# Altium schematic sheet MEMSAndAnalogFrontend.SchDoc
size A3; SheetNumber: 4; SheetTotal: 4
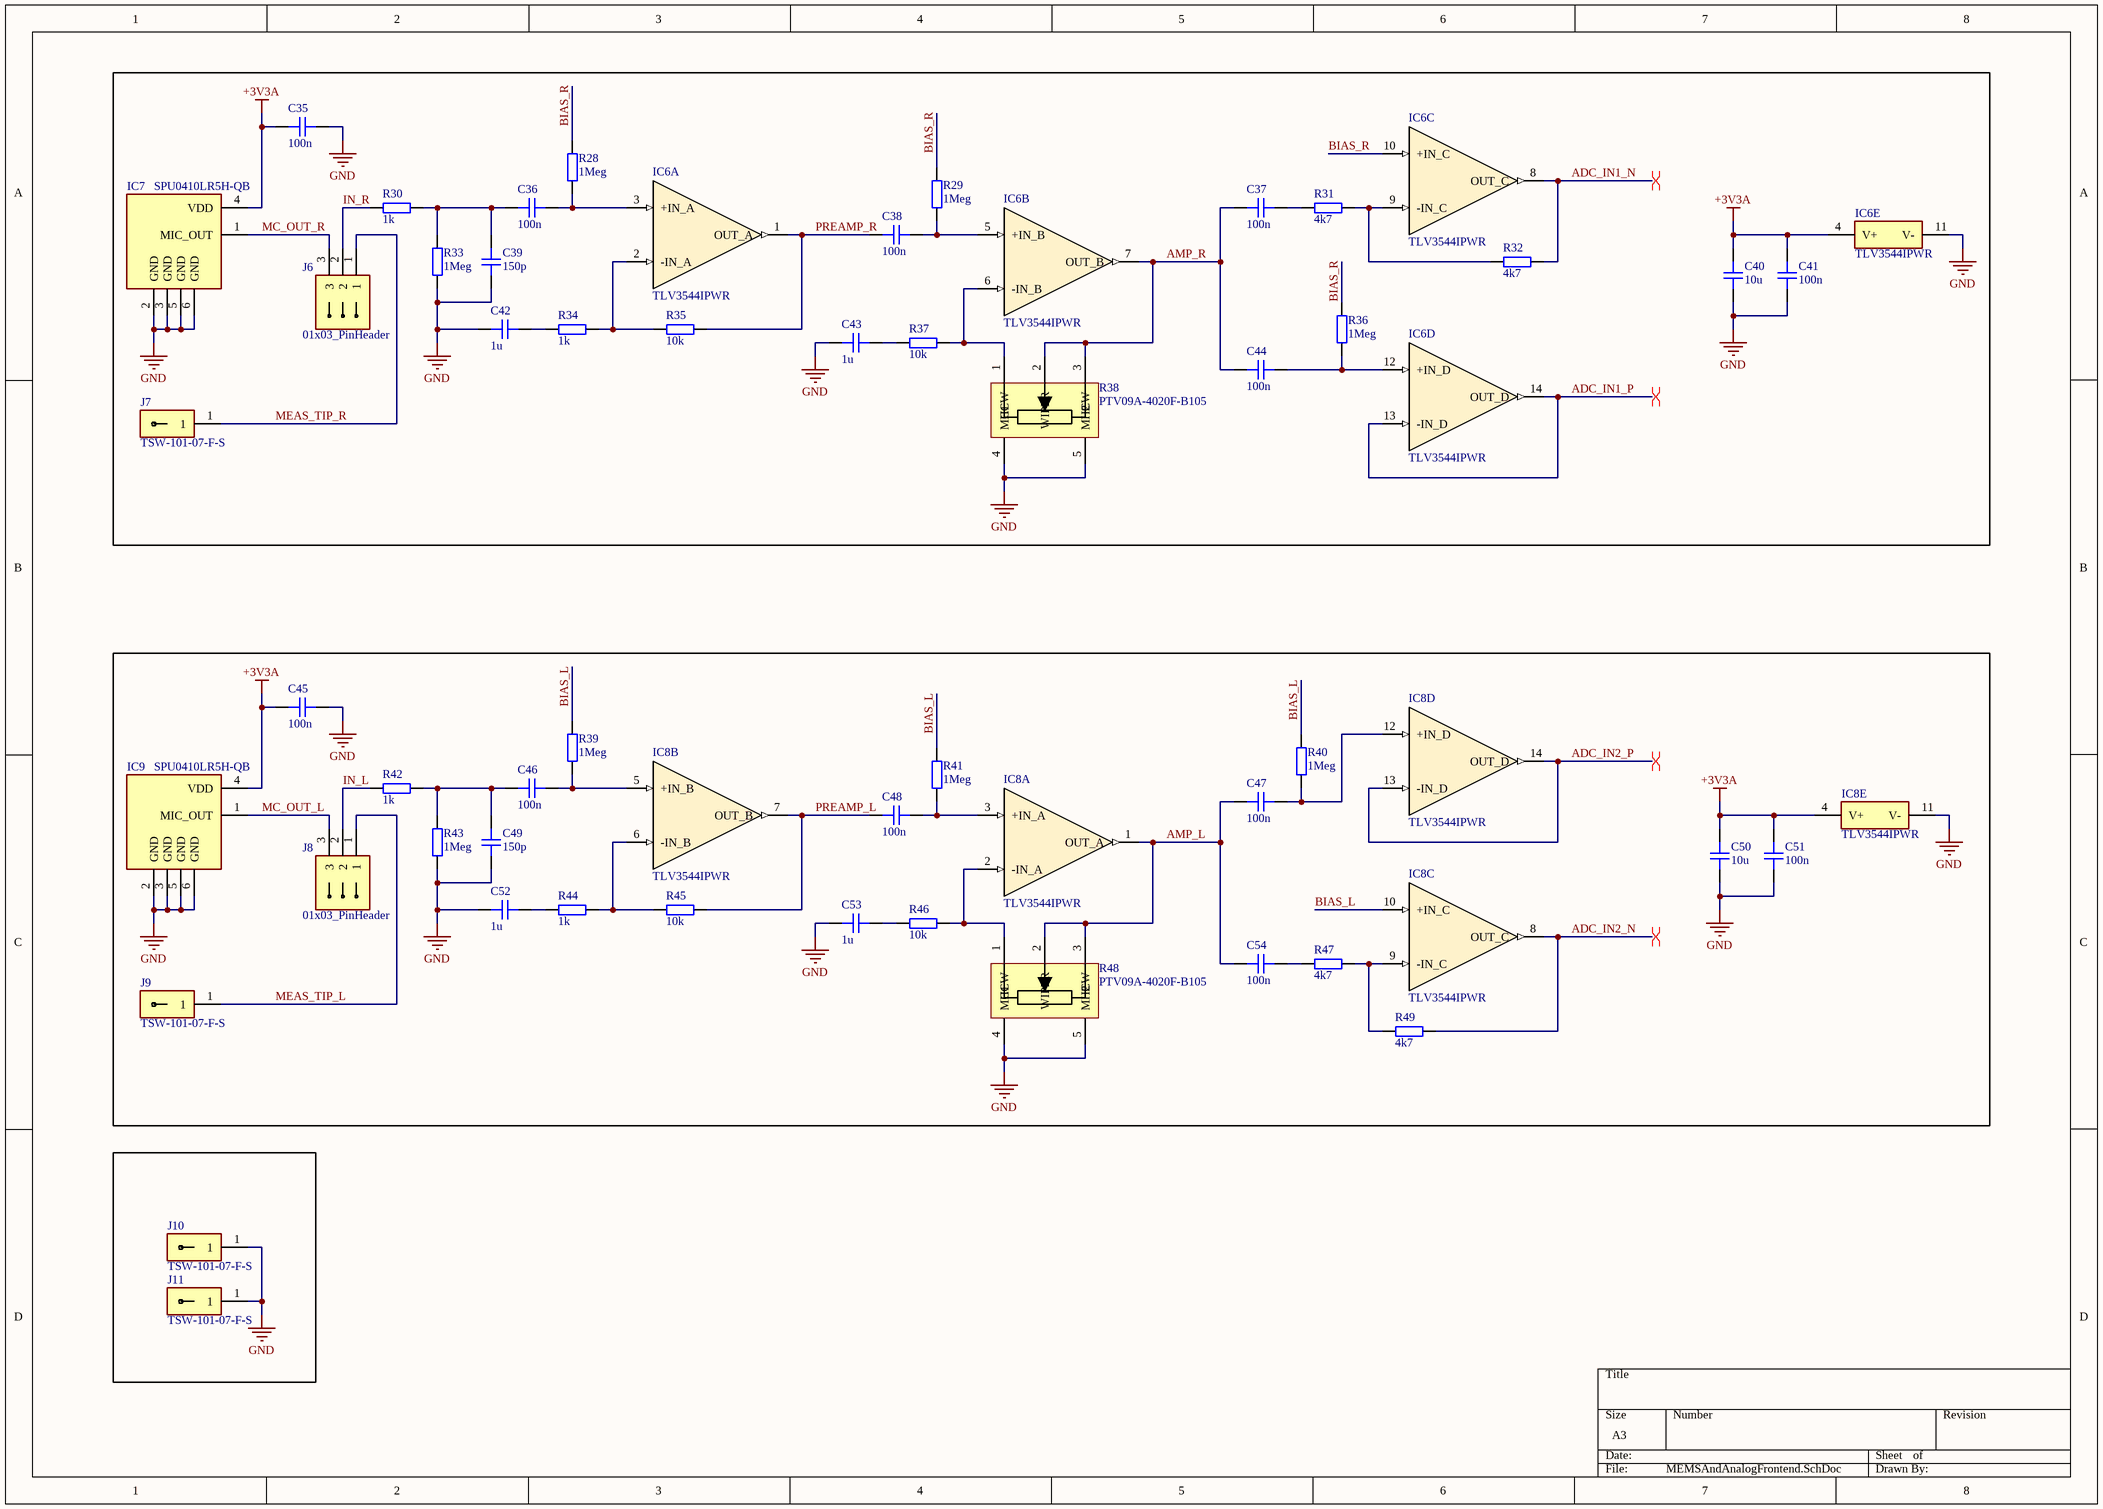
[diagram p0: MEMSAndAnalogFrontend.SchDoc]

## Parts
C35  100n  [CAP_0402]
C36  100n  [CAP_0402]
C37  100n  [CAP_0402]
C38  100n  [CAP_0402]
C39  150p  [CAP_0402]
C40  10u  [CAP_0603]
C41  100n  [CAP_0402]
C42  1u  [CAP_0402]
C43  1u  [CAP_0402]
C44  100n  [CAP_0402]
C45  100n  [CAP_0402]
C46  100n  [CAP_0402]
C47  100n  [CAP_0402]
C48  100n  [CAP_0402]
C49  150p  [CAP_0402]
C50  10u  [CAP_0603]
C51  100n  [CAP_0402]
C52  1u  [CAP_0402]
C53  1u  [CAP_0402]
C54  100n  [CAP_0402]
IC6  TLV3544IPWR  [SOP65P640X120-14N]  (parts A,B,C,D,E of 5)
IC7  SPU0410LR5H-QB  [SPU0410LR5H-QB]
IC8  TLV3544IPWR  [SOP65P640X120-14N]  (parts A,B,C,D,E of 5)
IC9  SPU0410LR5H-QB  [SPU0410LR5H-QB]
J6  01x03_PinHeader  [HDRV3W64P0X254_1X3_732X244X854P]
J7  TSW-101-07-F-S  [TSW-101-XX-YY-S]
J8  01x03_PinHeader  [HDRV3W64P0X254_1X3_732X244X854P]
J9  TSW-101-07-F-S  [TSW-101-XX-YY-S]
J10  TSW-101-07-F-S  [TSW-101-XX-YY-S]
J11  TSW-101-07-F-S  [TSW-101-XX-YY-S]
R28  1Meg  [RES_0402]
R29  1Meg  [RES_0402]
R30  1k  [RES_0402]
R31  4k7  [RES_0402]
R32  4k7  [RES_0402]
R33  1Meg  [RES_0402]
R34  1k  [RES_0402]
R35  10k  [RES_0402]
R36  1Meg  [RES_0402]
R37  10k  [RES_0402]
R38  PTV09A-4020F-B105  [PTV09A4020FB103]
R39  1Meg  [RES_0402]
R40  1Meg  [RES_0402]
R41  1Meg  [RES_0402]
R42  1k  [RES_0402]
R43  1Meg  [RES_0402]
R44  1k  [RES_0402]
R45  10k  [RES_0402]
R46  10k  [RES_0402]
R47  4k7  [RES_0402]
R48  PTV09A-4020F-B105  [PTV09A4020FB103]
R49  4k7  [RES_0402]

## Nets
+3V3A: C35.1 C40.2 C41.2 C45.1 C50.2 C51.2 IC6.4(V+) IC7.4(VDD) IC8.4(V+) IC9.4(VDD)
GND: C35.2 C39.2 C40.1 C41.1 C42.1 C43.1 C45.2 C49.2 C50.1 C51.1 C52.1 C53.1 IC6.11(V-) IC7.2(GND) IC7.3(GND) IC7.5(GND) IC7.6(GND) IC8.11(V-) IC9.2(GND) IC9.3(GND) IC9.5(GND) IC9.6(GND) J10.1 J11.1 R33.1 R38.4(MH1) R38.5(MH2) R43.1 R48.4(MH1) R48.5(MH2)
ADC_IN1_N: IC6.8(OUT_C) R32.2
ADC_IN1_P: IC6.13(-IN_D) IC6.14(OUT_D)
ADC_IN2_N: IC8.8(OUT_C) R49.2
ADC_IN2_P: IC8.13(-IN_D) IC8.14(OUT_D)
AMP_L: C47.2 C54.2 IC8.1(OUT_A) R48.2(WIPER) R48.3(CW)
AMP_R: C37.2 C44.2 IC6.7(OUT_B) R38.2(WIPER) R38.3(CW)
BIAS_L: IC8.10(+IN_C) R39.2 R40.2 R41.2
BIAS_R: IC6.10(+IN_C) R28.2 R29.2 R36.2
IN_L: J8.2 R42.1
IN_R: J6.2 R30.1
MC_OUT_L: IC9.1(MIC_OUT) J8.3
MC_OUT_R: IC7.1(MIC_OUT) J6.3
MEAS_TIP_L: J8.1 J9.1
MEAS_TIP_R: J6.1 J7.1
PREAMP_L: C48.2 IC8.7(OUT_B) R45.2
PREAMP_R: C38.2 IC6.1(OUT_A) R35.2
NetC36_1: C36.1 IC6.3(+IN_A) R28.1
NetC36_2: C36.2 C39.1 R30.2 R33.2
NetC37_1: C37.1 R31.1
NetC38_1: C38.1 IC6.5(+IN_B) R29.1
NetC42_2: C42.2 R34.1
NetC43_2: C43.2 R37.1
NetC44_1: C44.1 IC6.12(+IN_D) R36.1
NetC46_1: C46.1 IC8.5(+IN_B) R39.1
NetC46_2: C46.2 C49.1 R42.2 R43.2
NetC47_1: C47.1 IC8.12(+IN_D) R40.1
NetC48_1: C48.1 IC8.3(+IN_A) R41.1
NetC52_2: C52.2 R44.1
NetC53_2: C53.2 R46.1
NetC54_1: C54.1 R47.1
NetIC6_2: IC6.2(-IN_A) R34.2 R35.1
NetIC6_6: IC6.6(-IN_B) R37.2 R38.1(CCW)
NetIC6_9: IC6.9(-IN_C) R31.2 R32.1
NetIC8_2: IC8.2(-IN_A) R46.2 R48.1(CCW)
NetIC8_6: IC8.6(-IN_B) R44.2 R45.1
NetIC8_9: IC8.9(-IN_C) R47.2 R49.1

## Layout directives
differential pair: ADC_IN1_N, ADC_IN1_P, ADC_IN2_N, ADC_IN2_P

## Library data of the parts
C35-C39 C41-C49 C51-C54 = CAP_0402: Capacitor SMD 0402; Manufacturer: *; Manufacturer Part Number: *; Distributor Link: *; LCSC: *; Rating: *; Dielectric: *
C40 C50 = CAP_0603: Capacitor SMD 0603; Manufacturer: *; Manufacturer Part Number: *; Distributor Link: *; LCSC: *; Rating: *; Dielectric: *
IC6 IC8 = TLV3544IPWR: Integrated Circuit; Manufacturer_Name: Texas Instruments; Datasheet Link: http://www.ti.com/lit/gpn/tlv3544; Height: 1.2mm; Manufacturer_Part_Number: TLV3544IPWR; Mouser Part Number: 595-TLV3544IPWR; Mouser Price/Stock: https://www.mouser.co.uk/ProductDetail/Texas-Instruments/TLV3544IPWR?qs=9lcNTSmDlCo%2FGPDLoAm6Jw%3D%3D; Arrow Part Number: TLV3544IPWR; Arrow Price/Stock: https://www.arrow.com/en/products/tlv3544ipwr/texas-instruments
IC7 IC9 = SPU0410LR5H-QB: Knowles - MEMS Microphones MIC MEMS ANALOG OMNI -38DB
J6 J8 = 01x03_PinHeader: Connector; Manufacturer_Name: Hirose; Manufacturer_Part_Number: A2-3PA-2.54DSA(71); Datasheet Link: https://datasheet.lcsc.com/szlcsc/Hirose-HRS-A2-3PA-2-54DSA-71_C325000.pdf; Height: 8.54mm; Mouser Part Number: 798-A23PA254DSA71; Mouser Price/Stock: https://www.mouser.co.uk/ProductDetail/Hirose-Connector/A2-3PA-2.54DSA71?qs=eDUdFcBPps3wMwa6hYzhLw%3D%3D; Arrow Part Number: A2-3PA-2.54DSA(71); Arrow Price/Stock: https://www.arrow.com/en/products/a2-3pa-2.54dsa-71/hirose-electric
J7 J9-J11 = TSW-101-07-F-S: Connector; Manufacturer_Name: SAMTEC; Datasheet Link: http://suddendocs.samtec.com/prints/tsw-xxx-xx-xxx-x-xx-xxx-mkt.pdf; Manufacturer_Part_Number: TSW-101-07-F-S; Mouser Part Number: 200-TSW10107FS; Mouser Price/Stock: https://www.mouser.co.uk/ProductDetail/Samtec/TSW-101-07-F-S?qs=rU5fayqh%252BE1FyeYHuHva5w%3D%3D; Arrow Part Number: TSW-101-07-F-S; Arrow Price/Stock: https://www.arrow.com/en/products/tsw-101-07-f-s/samtec?region=nac
R28-R37 R39-R47 R49 = RES_0402: Resistor SMD 0402; Manufacturer: *; Manufacturer Part Number: *; Distributor Link: *; LCSC: *
R38 R48 = PTV09A-4020F-B105: Variable Resistor; Manufacturer_Name: Bourns; Datasheet Link: https://www.bourns.com/docs/Product-Datasheets/ptv09.pdf; Height: 20mm; Manufacturer_Part_Number: PTV09A-4020F-B105; Mouser Part Number: 652-PTV09A4020FB105; Mouser Price/Stock: https://www.mouser.co.uk/ProductDetail/Bourns/PTV09A-4020F-B105?qs=%252B9%2Fcbd0IE0TagBKq%252BGRbqw%3D%3D; Arrow Part Number: PTV09A-4020F-B105; Arrow Price/Stock: https://www.arrow.com/en/products/ptv09a-4020f-b105/bourns?region=nac